# Altium schematic sheet Base IC.SchDoc: FluidGuard(TX) MCU BLOCK
size A4; SheetNumber: 1; SheetTotal: 5
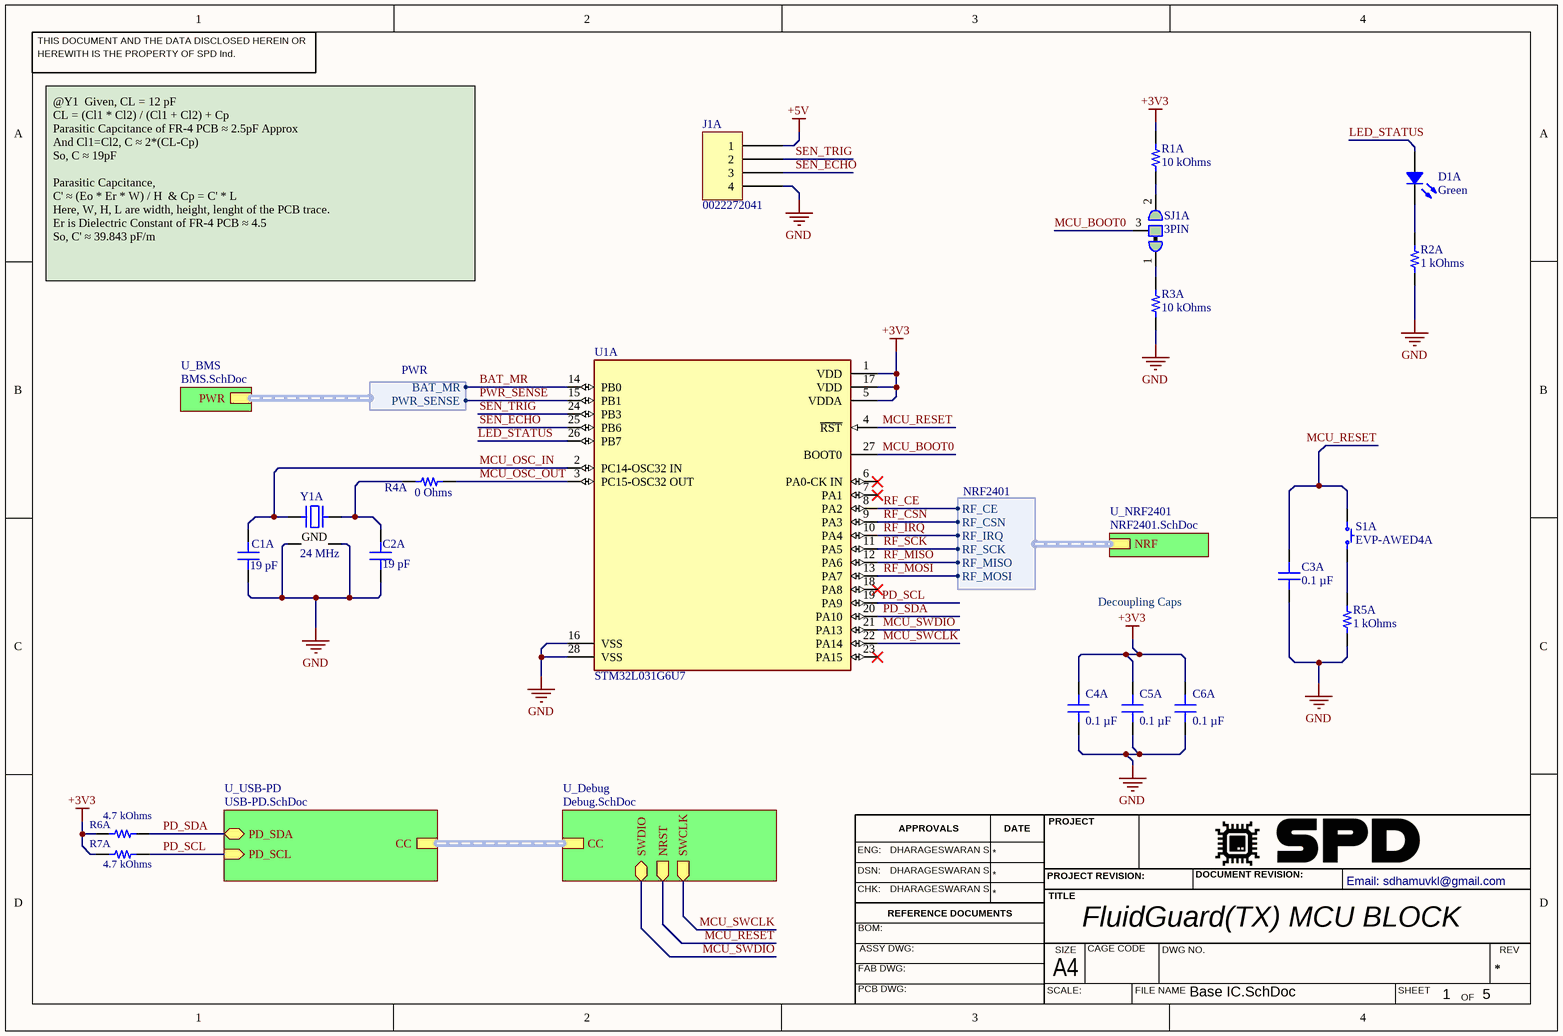
[diagram p0: Base IC.SchDoc]

## Parts
C1A  19 pF  [CAP 0402_1005]
C2A  19 pF  [CAP 0402_1005]
C3A  0.1 µF  [CAP 0402_1005]
C4A  0.1 µF  [CAP 0402_1005]
C5A  0.1 µF  [CAP 0402_1005]
C6A  0.1 µF  [CAP 0402_1005]
D1A  Green  [LED 0402_1005 GREEN]
J1A  0022272041  [MOLEX KK 0022272041]
R1A  10 kOhms  [RES 0402_1005]
R2A  1 kOhms  [RES 0402_1005]
R3A  10 kOhms  [RES 0402_1005]
R4A  0 Ohms  [RES 0402_1005]
R5A  1 kOhms  [RES 0402_1005]
R6A  4.7 kOhms  [RES 0402_1005]
R7A  4.7 kOhms  [RES 0402_1005]
S1A  EVP-AWED4A  [PANASONIC EVPAW]
SJ1A  3PIN  [Rounded Jumper Joint 3-pin]
U1A  STM32L031G6U7  [FP-UFQFPN28-A0B0-MFG]
Y1A  24 MHz  [EPSON TSX-3225]

## Sub-sheets
U_BMS = BMS.SchDoc: PWR (harness PWR)
U_Debug = Debug.SchDoc: SWDIO (bidir), SWCLK (out), NRST (out), CC (harness CC)
U_NRF2401 = NRF2401.SchDoc: NRF (harness NRF2401)
U_USB-PD = USB-PD.SchDoc: PD_SDA (bidir), PD_SCL (in), CC (harness CC)

## Harnesses
NRF2401: RF_CE, RF_CSN, RF_IRQ, RF_SCK, RF_MISO, RF_MOSI
PWR: BAT_MR, PWR_SENSE

## Nets
+3V3: C4A.2 C5A.2 C6A.2 R1A.2 R6A.2 R7A.2 U1A.1(VDD) U1A.5(VDDA) U1A.17(VDD)
+5V: J1A.1
GND: C1A.1 C2A.1 C3A.1 C4A.1 C5A.1 C6A.1 J1A.4 R2A.1 R3A.1 R5A.1 U1A.16(VSS) U1A.28(VSS) Y1A.2(GND) Y1A.4(GND)
BAT_MR: U1A.14(PB0) ; sheet U_BMS/PWR.BAT_MR
LED_STATUS: D1A.1 U1A.26(PB7)
MCU_BOOT0: SJ1A.3 U1A.27(BOOT0)
MCU_OSC_IN: C1A.2 U1A.2(PC14-OSC32_IN) Y1A.1
MCU_OSC_OUT: R4A.2 U1A.3(PC15-OSC32_OUT)
MCU_RESET: C3A.2 S1A.1 U1A.4(~{RST}) ; sheet U_Debug/NRST
MCU_SWCLK: U1A.22(PA14) ; sheet U_Debug/SWCLK
MCU_SWDIO: U1A.21(PA13) ; sheet U_Debug/SWDIO
PD_SCL: R7A.1 U1A.19(PA9) ; sheet U_USB-PD/PD_SCL
PD_SDA: R6A.1 U1A.20(PA10) ; sheet U_USB-PD/PD_SDA
PWR_SENSE: U1A.15(PB1) ; sheet U_BMS/PWR.PWR_SENSE
RF_CE: U1A.8(PA2) ; sheet U_NRF2401/NRF.RF_CE
RF_CSN: U1A.9(PA3) ; sheet U_NRF2401/NRF.RF_CSN
RF_IRQ: U1A.10(PA4) ; sheet U_NRF2401/NRF.RF_IRQ
RF_MISO: U1A.12(PA6) ; sheet U_NRF2401/NRF.RF_MISO
RF_MOSI: U1A.13(PA7) ; sheet U_NRF2401/NRF.RF_MOSI
RF_SCK: U1A.11(PA5) ; sheet U_NRF2401/NRF.RF_SCK
SEN_ECHO: J1A.3 U1A.25(PB6)
SEN_TRIG: J1A.2 U1A.24(PB3)
NetC2A_2: C2A.2 R4A.1 Y1A.3
NetD1A_2: D1A.2 R2A.2
NetR1A_1: R1A.1 SJ1A.2
NetR3A_2: R3A.2 SJ1A.1
NetR5A_2: R5A.2 S1A.2

Not connected (* = marked no-connect by the designer): U1A 6(PA0-CK_IN)* 7(PA1)* 18(PA8)* 23(PA15)*

## Buses and harness runs
harness sheet U_Debug/CC = sheet U_USB-PD/CC

## Notes on the sheet
- @Y1  Given, CL = 12 pF
  CL = (Cl1 * Cl2) / (Cl1 + Cl2) + Cp
  Parasitic Capcitance of FR-4 PCB ≈ 2.5pF Approx
  And Cl1=Cl2, C ≈ 2*(CL-Cp)
  So, C ≈ 19pF
  Parasitic Capcitance,
  C' ≈ (Eo * Er * W) / H  & Cp = C' * L
  Here, W, H, L are width, height, lenght of the PCB trace.
  Er is Dielectric Constant of FR-4 PCB ≈ 4.5
  So, C' ≈ 39.843 pF/m
- Decoupling Caps
- THIS DOCUMENT AND THE DATA DISCLOSED HEREIN OR
- HEREWITH IS THE PROPERTY OF SPD Ind.
- ENG:
- DHARAGESWARAN S
- APPROVALS
- DATE
- PROJECT
- DSN:
- CHK:
- REFERENCE DOCUMENTS
- PROJECT REVISION:
- TITLE
- DOCUMENT REVISION:
- Email: sdhamuvkl@gmail.com <https://github.com/DhamuVkl>
- BOM:
- FAB DWG:
- PCB DWG:
- ASSY DWG:
- SCALE:
- A4
- SIZE
- CAGE CODE
- FILE NAME
- DWG NO.
- SHEET
- REV
- OF

## Library data of the parts
C1A C2A = GJM1555C1H190GB01D: CAP CER 19PF 50VDC 0402 C0G 2%; Manufacturer: Murata Electronics; id: 5279; Temperature Coefficient: C0G, NP0; Voltage - Rated: 50V; Part Number: GJM1555C1H190GB01D; Value: 19 pF; Supplier Part Number 1: 490-GJM1555C1H190GB01DCT-ND; ComponentLink2Description: DigiKey Link; Features: High Q, Low Loss; ComponentLink1URL: https://search.murata.co.jp/Ceramy/image/img/A01X/G101/ENG/GJM1555C1H190GB01-01A.pdf; PartId: 41775; Tolerance: ±2%; Supplier 1: DigiKey; Series: GJM; LastUpdated: 2023-01-03T20:03:22.137; Part Status: Active; Capacitance: 19 pF; Device Package: 0402 (1005 Metric); Thickness (Max): 0.022" (0.55mm); Minimum Order: 1; Packaging: TapeAndReel; Applications: RF, Microwave, High Frequency; Package / Case: 0402 (1005 Metric); ComponentLink1Description: Datasheet; Price: 0.02; ComponentLink2URL: https://www.digikey.com/en/products/detail/murata-electronics/GJM1555C1H190GB01D/16033843; Lifecycle Status: Active; Operating Temperature: -55°C ~ 125°C; Size / Dimension: 0.039" L x 0.020" W (1.00mm x 0.50mm); Mounting Type: Surface Mount, MLCC
C3A C4A C5A C6A = CL05B104KP5VPNC: CAP CER 100NF 10V X7R 0402; Manufacturer: Samsung Electro-Mechanics; id: 7736; Tolerance: ±10%; Part Number: CL05B104KP5VPNC; Value: 0.1 µF; Temperature Coefficient: X7R; Supplier Part Number 1: 1276-CL05B104KP5VPNCCT-ND; ComponentLink2Description: DigiKey Link; ComponentLink1URL: https://mm.digikey.com/Volume0/opasdata/d220001/medias/docus/5458/CL05B104KP5VPNC_Spec.pdf; PartId: 56690; Supplier 1: DigiKey; Series: CL; LastUpdated: 2023-11-05T20:02:55.743; Capacitance: 0.1 µF; Device Package: 0402 (1005 Metric); Ratings: AEC-Q200; Thickness (Max): 0.022" (0.55mm); Voltage - Rated: 10V; Minimum Order: 1; Packaging: TapeAndReel; Applications: Automotive; Package / Case: 0402 (1005 Metric); ComponentLink1Description: Datasheet; Price: 0.01; ComponentLink2URL: https://www.digikey.com/en/products/detail/samsung-electro-mechanics/CL05B104KP5VPNC/20498482; Lifecycle Status: Active; Operating Temperature: -55°C ~ 125°C; Size / Dimension: 0.039" L x 0.020" W (1.00mm x 0.50mm); Mounting Type: Surface Mount, MLCC
D1A = HSMG-C280: LED GREEN DIFFUSED 0402 SMD; Manufacturer: Broadcom Limited; id: 697; Lens Color: White; Wavelength - Peak: 570nm; Lens Style: Rectangle with Flat Top; Viewing Angle: 130°; Lens Size: 1.00mm x 0.50mm; Configuration: Standard; Wavelength - Dominant: 572nm; Voltage - Forward (Vf) (Typ): 2.2V; Current - Test: 20mA; Millicandela Rating: 15mcd; Part Number: HSMG-C280; Supplier Part Number 1: 516-3066-1-ND; Lens Transparency: Diffused; Supplier Device Package: 0402; ComponentLink1Description: Datasheet; Color: Green; ComponentLink2URL: https://www.digikey.com/en/products/detail/broadcom-limited/HSMG-C280/1235358; ComponentLink1URL: https://docs.broadcom.com/docs/AV02-0602EN; Supplier 1: DigiKey; Series: -; Height (Max): 0.40mm; Part Status: Active; ComponentLink2Description: DigiKey Link; Device Package: 0402 (1005 Metric); Packaging: TapeAndReel; Minimum Order: 1; Package / Case: 0402 (1005 Metric); PartId: 697; Lifecycle Status: Active; LastUpdated: 2023-01-02T20:56:26.750; Value: Green; Size / Dimension: 1.00mm L x 0.50mm W; Mounting Type: Surface Mount; Price: 0.08
J1A = 0022272041: CONN HEADER VERT 4POS 2.54MM; Manufacturer: Molex; id: 78; Style: Board to Cable/Wire; Contact Length - Mating: 0.295" (7.49mm); Pitch - Mating: 0.100" (2.54mm); Number Of Positions: 4; Number Of Positions Loaded: All; Shrouding: Shrouded - 1 Wall; Material Flammability Rating: UL94 V-0; Overall Contact Length: 0.560" (14.22mm); Contact Length - Post: 0.140" (3.56mm); Part Number: 0022272041; Supplier Part Number 1: WM4113-ND; Contact Shape: Square; Termination: Solder; ComponentLink1Description: Datasheet; Connector Type: Header; Contact Material: Brass; ComponentLink2URL: http://digikey.com/product-detail/en/molex/0022272041/WM4113-ND/1130579; Contact Finish - Mating: Tin; ComponentLink1URL: https://www.molex.com/pdm_docs/sd/022272041_sd.pdf; Fastening Type: Friction Lock; Supplier 1: DigiKey; Number Of Rows: 1; Series: KK 6410; Part Status: Active; ComponentLink2Description: DigiKey Link; Contact Type: Male Pin; Packaging: Bulk; Insulation Height: 0.461" (11.70mm); Contact Finish - Post: Tin; Contact Finish Thickness - Mating: 100.0µin (2.54µm); Minimum Order: 1; PartId: 78; Lifecycle Status: Active; LastUpdated: 2020-01-12T23:52:05.287; Insulation Color: Natural; Mounting Type: Through Hole; Insulation Material: Polyamide (PA), Nylon; Price: 0.40
R1A R3A = AA0402FR-0710KL: RES SMD 10K OHM 1% 1/16W 0402; Manufacturer: Yageo; id: 10610; Temperature Coefficient: ±150ppm/°C; Power (Watts): 0.063W, 1/16W; Part Number: AA0402FR-0710KL; Height - Seated (Max): 0.015" (0.37mm); Supplier Part Number 1: 13-AA0402FR-0710KLCT-ND; Supplier Device Package: 0402; ComponentLink1Description: Datasheet; ComponentLink2URL: https://www.digikey.com/en/products/detail/yageo/AA0402FR-0710KL/5887729; Features: Anti-Sulfur, Automotive AEC-Q200, Moisture Resistant; ComponentLink1URL: https://www.yageo.com/upload/media/product/productsearch/datasheet/rchip/PYu-AA_51_RoHS_L_3.pdf; Composition: Thick Film; Tolerance: ±1%; Supplier 1: DigiKey; Series: AA; Part Status: Active; ComponentLink2Description: DigiKey Link; Device Package: 0402 (1005 Metric); Packaging: TapeAndReel; Ratings: AEC-Q200; Minimum Order: 1; Package / Case: 0402 (1005 Metric); PartId: 59190; Lifecycle Status: Active; LastUpdated: 2023-01-02T20:20:10.303; Operating Temperature: -55°C ~ 155°C; Number Of Terminations: 2; Value: 10 kOhms; Size / Dimension: 0.039" L x 0.020" W (1.00mm x 0.50mm); Price: 0.01; Resistance: 10 kOhms
R2A R5A = AA0402FR-071KL: RES SMD 1K OHM 1% 1/16W 0402; Manufacturer: Yageo; id: 10598; Temperature Coefficient: ±150ppm/°C; Power (Watts): 0.063W, 1/16W; Part Number: AA0402FR-071KL; Height - Seated (Max): 0.015" (0.37mm); Supplier Part Number 1: 13-AA0402FR-071KLCT-ND; Supplier Device Package: 0402; ComponentLink1Description: Datasheet; ComponentLink2URL: https://www.digikey.com/en/products/detail/yageo/AA0402FR-071KL/5887878; Features: Anti-Sulfur, Automotive AEC-Q200, Moisture Resistant; ComponentLink1URL: https://www.yageo.com/upload/media/product/productsearch/datasheet/rchip/PYu-AA_51_RoHS_L_3.pdf; Composition: Thick Film; Tolerance: ±1%; Supplier 1: DigiKey; Series: AA; Part Status: Active; ComponentLink2Description: DigiKey Link; Device Package: 0402 (1005 Metric); Packaging: TapeAndReel; Ratings: AEC-Q200; Minimum Order: 1; Package / Case: 0402 (1005 Metric); PartId: 59178; Lifecycle Status: Active; LastUpdated: 2023-01-02T20:20:10.210; Operating Temperature: -55°C ~ 155°C; Number Of Terminations: 2; Value: 1 kOhms; Size / Dimension: 0.039" L x 0.020" W (1.00mm x 0.50mm); Price: 0.01; Resistance: 1 kOhms
R4A = AC0402JR-070RL: RES SMD 0 OHM JUMPER 1/16W 0402; Manufacturer: Yageo; id: 9339; Power (Watts): 0.063W, 1/16W; Part Number: AC0402JR-070RL; Height - Seated (Max): 0.015" (0.37mm); Supplier Part Number 1: 311-0.0LBCT-ND; Supplier Device Package: 0402; ComponentLink1Description: Datasheet; ComponentLink2URL: https://www.digikey.com/en/products/detail/yageo/AC0402JR-070RL/2827807; Features: Automotive AEC-Q200, Moisture Resistant; ComponentLink1URL: https://www.yageo.com/upload/media/product/productsearch/datasheet/rchip/PYu-AC_51_RoHS_L_7.pdf; Composition: Thick Film; Tolerance: Jumper; Supplier 1: DigiKey; Series: AC; Part Status: Active; ComponentLink2Description: DigiKey Link; Device Package: 0402 (1005 Metric); Packaging: CutTape; Ratings: AEC-Q200; Minimum Order: 1; Package / Case: 0402 (1005 Metric); PartId: 20617; Lifecycle Status: Active; LastUpdated: 2023-01-02T20:20:32.243; Operating Temperature: -55°C ~ 155°C; Number Of Terminations: 2; Value: 0 Ohms; Size / Dimension: 0.039" L x 0.020" W (1.00mm x 0.50mm); Price: 0.01; Resistance: 0 Ohms
R6A R7A = AC0402FR-074K7L: RES SMD 4.7K OHM 1% 1/16W 0402; Manufacturer: Yageo; id: 4996; Temperature Coefficient: ±100ppm/°C; Power (Watts): 0.063W, 1/16W; Part Number: AC0402FR-074K7L; Height - Seated (Max): 0.015" (0.37mm); Supplier Part Number 1: YAG3497CT-ND; Supplier Device Package: 0402; ComponentLink1Description: Datasheet; ComponentLink2URL: https://www.digikey.com/en/products/detail/yageo/AC0402FR-074K7L/5895396; Features: Automotive AEC-Q200, Moisture Resistant; ComponentLink1URL: https://www.yageo.com/upload/media/product/productsearch/datasheet/rchip/PYu-AC_51_RoHS_L_7.pdf; Composition: Thick Film; Tolerance: ±1%; Supplier 1: DigiKey; Series: AC; Part Status: Active; ComponentLink2Description: DigiKey Link; Device Package: 0402 (1005 Metric); Packaging: CutTape; Ratings: AEC-Q200; Minimum Order: 1; Package / Case: 0402 (1005 Metric); PartId: 12051; Lifecycle Status: Active; LastUpdated: 2023-01-02T20:21:09.847; Operating Temperature: -55°C ~ 155°C; Number Of Terminations: 2; Value: 4.7 kOhms; Size / Dimension: 0.039" L x 0.020" W (1.00mm x 0.50mm); Price: 0.01; Resistance: 4.7 kOhms
S1A = EVP-AWED4A: 3.0MM X 2.0MM / 3.3N / 0.15MM ST; Manufacturer: Panasonic Electronic Components; id: 5; Switch Function: Off-Mom; Contact Rating @ Voltage: 0.02A @ 15VDC; Outline: 3.00mm x 2.00mm; Actuator Height Off Pcb, Vertical: 0.60mm; Ingress Protection: IP67 - Dust Tight, Waterproof; Actuator Orientation: Top Actuated; Actuator Type: Standard; Illumination: Non-Illuminated; Operating Force: 330gf; Circuit: SPST-NO; Part Number: EVP-AWED4A; Supplier Part Number 1: P123440CT-ND; ComponentLink1Description: Datasheet; ComponentLink2URL: https://www.digikey.com/en/products/detail/panasonic-electronic-components/EVP-AWED4A/8568275; ComponentLink1URL: https://industrial.panasonic.com/ac/cdn/e/control/switch/light-touch/catalog/sw_lt_eng_3020s.pdf; Supplier 1: DigiKey; Series: EVPAW; Part Status: Active; ComponentLink2Description: DigiKey Link; Packaging: TapeAndReel; Minimum Order: 1; Lifecycle Status: Active; LastUpdated: 2023-01-02T21:07:29.980; Termination Style: SMD (SMT) Tab; Operating Temperature: -40°C ~ 85°C; Mounting Type: Surface Mount; Price: 0.16
SJ1A = Rounded Jumper Joint 3-pin
U1A = CMP-12105-000084-1: IC MCU 32BIT 32KB FLASH 28UFQFPN; Oscillator Type: Internal; Core Architecture: ARM; Peripherals: Brown-out Detect/Reset; Interface: I2C; Watchdog Timer: Yes; Max Power Dissipation: 167mW; Max Frequency: 32MHz; Operating Supply Voltage: 3.3V; Number of Timers/Counters: 4; Max Supply Voltage: 3.6V; RAM Size: 1KB; Number of Programmable I/O: 21; Min Supply Voltage: 1.8V; Lead Free: Lead Free; Mount: Surface Mount; Min Operating Temperature: -40°C; Frequency: 32MHz; Max Operating Temperature: 105°C; Number of Pins: 28; Memory Type: FLASH; Number of I/Os: 21; Memory Size: 32KB
Y1A = TSX-3225 24.0000MF15X-AC3: CRYSTAL 24.0000MHZ 9PF SMD; Manufacturer: EPSON; id: 441; Frequency Tolerance: ±10ppm; Frequency Stability: ±15ppm; Operating Mode: Fundamental; Esr (Equivalent Series Resistance): 40 Ohms; Part Number: TSX-3225 24.0000MF15X-AC3; Height - Seated (Max): 0.024" (0.60mm); Supplier Part Number 1: SER3635CT-ND; ComponentLink1Description: Datasheet; ComponentLink2URL: https://www.digikey.com/en/products/detail/epson/TSX-3225-24-0000MF15X-AC3/1825444; ComponentLink1URL: https://support.epson.biz/td/api/doc_check.php?dl=brief_TSX-3225&lang=en; Supplier 1: DigiKey; Frequency: 24 MHz; Series: TSX-3225; Part Status: Active; Type: MHz Crystal; ComponentLink2Description: DigiKey Link; Packaging: TapeAndReel; Minimum Order: 1; Package / Case: 4-SMD, No Lead; PartId: 441; Lifecycle Status: Active; LastUpdated: 2023-01-02T20:58:19.840; Operating Temperature: -40°C ~ 85°C; Value: 24 MHz; Size / Dimension: 0.126" L x 0.098" W (3.20mm x 2.50mm); Mounting Type: Surface Mount; Price: 0.44; Load Capacitance: 9pF